# Altium schematic sheet memory.SchDoc: Memmory interface
size A4; SheetNumber: 10; SheetTotal: 10; Project: WSN Z1; Comments: M25P* EEPROMS
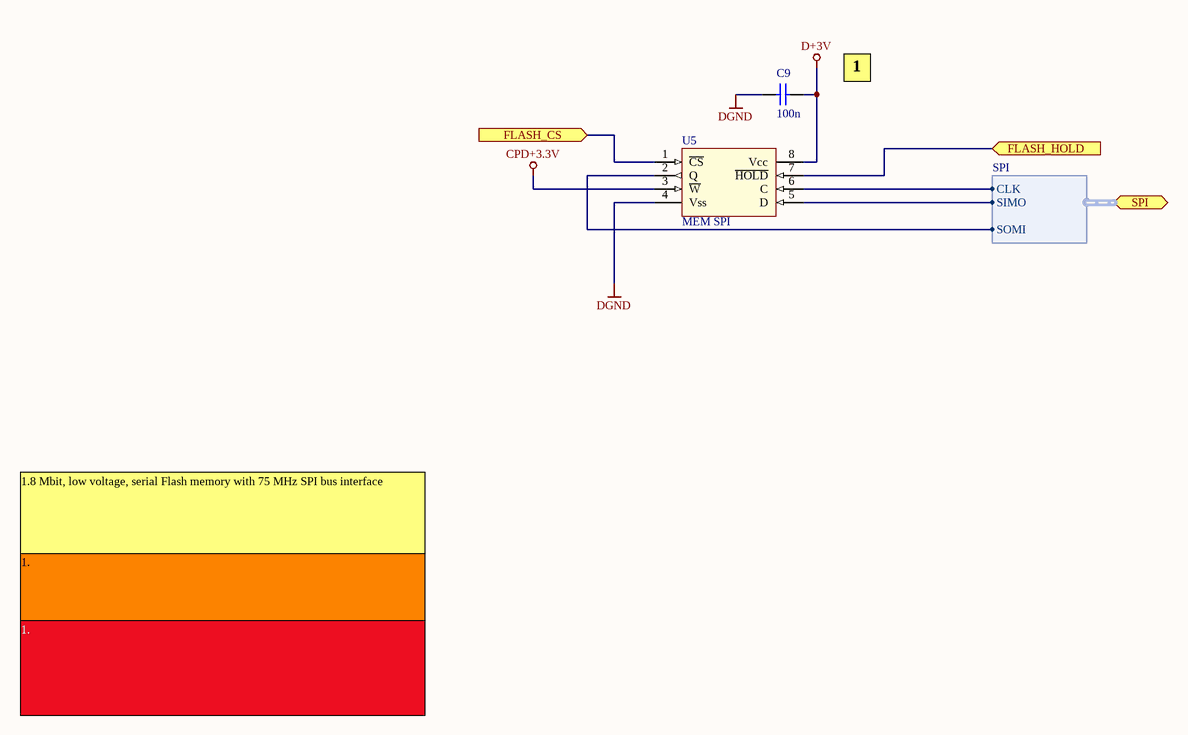
[diagram p0: memory.SchDoc]

## Parts
C9  value 100n  [CC-0402-AL]  (hidden comment: Cap Semi)
U5  MEM SPI  [VFQFPN8]

## Ports
FLASH_CS (in), FLASH_HOLD (in), SPI (harness SPI)

## Harnesses
SPI: CLK, SOMI, SIMO

## Nets
CPD+3.3V: U5.3(~{W})
D+3V: C9.2 U5.8(Vcc)
DGND: C9.1 U5.4(Vss)
FLASH_CS: U5.1(~{CS}) ; port FLASH_CS
FLASH_HOLD: U5.7(~{HOLD}) ; port FLASH_HOLD
NetU5_2: U5.2(Q) ; port SPI.SOMI
NetU5_5: U5.5(D) ; port SPI.SIMO
NetU5_6: U5.6(C) ; port SPI.CLK

## Notes on the sheet
- 1
- 1.8 Mbit, low voltage, serial Flash memory with 75 MHz SPI bus interface
- 1.

## Library data of the parts
C9 = Cap Semi: Capacitor (Semiconductor SIM Model)
U5 = M25P80: 8 Mbit, low voltage, serial Flash memory  with 75 MHz SPI bus interface